# Altium schematic sheet USB_HUB.SchDoc
size A0
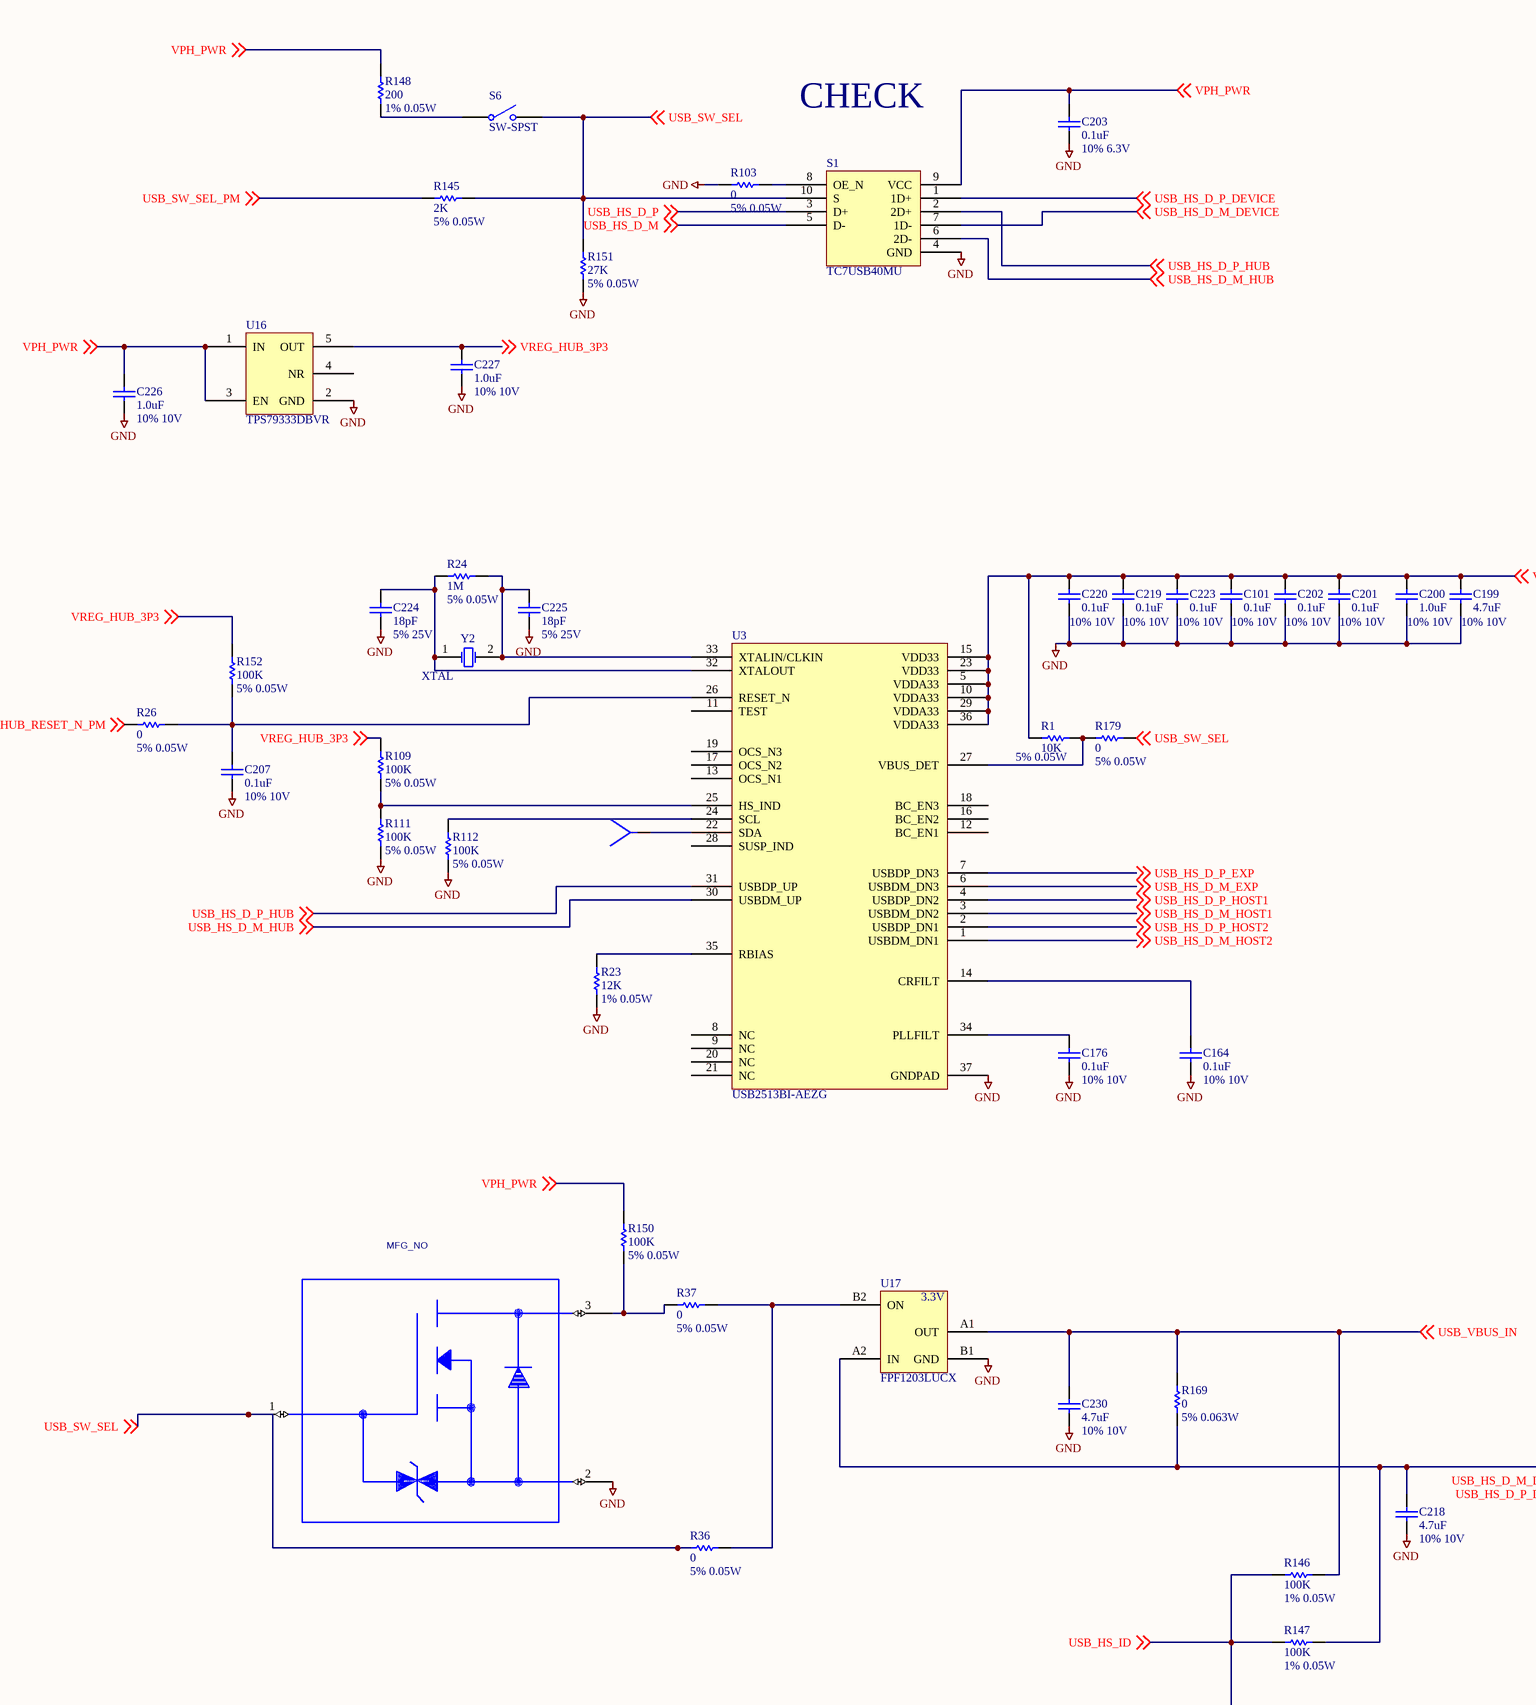
[diagram p0: USB_HUB.SchDoc, top left]
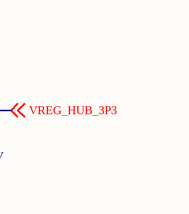
[diagram p1: USB_HUB.SchDoc, top right]
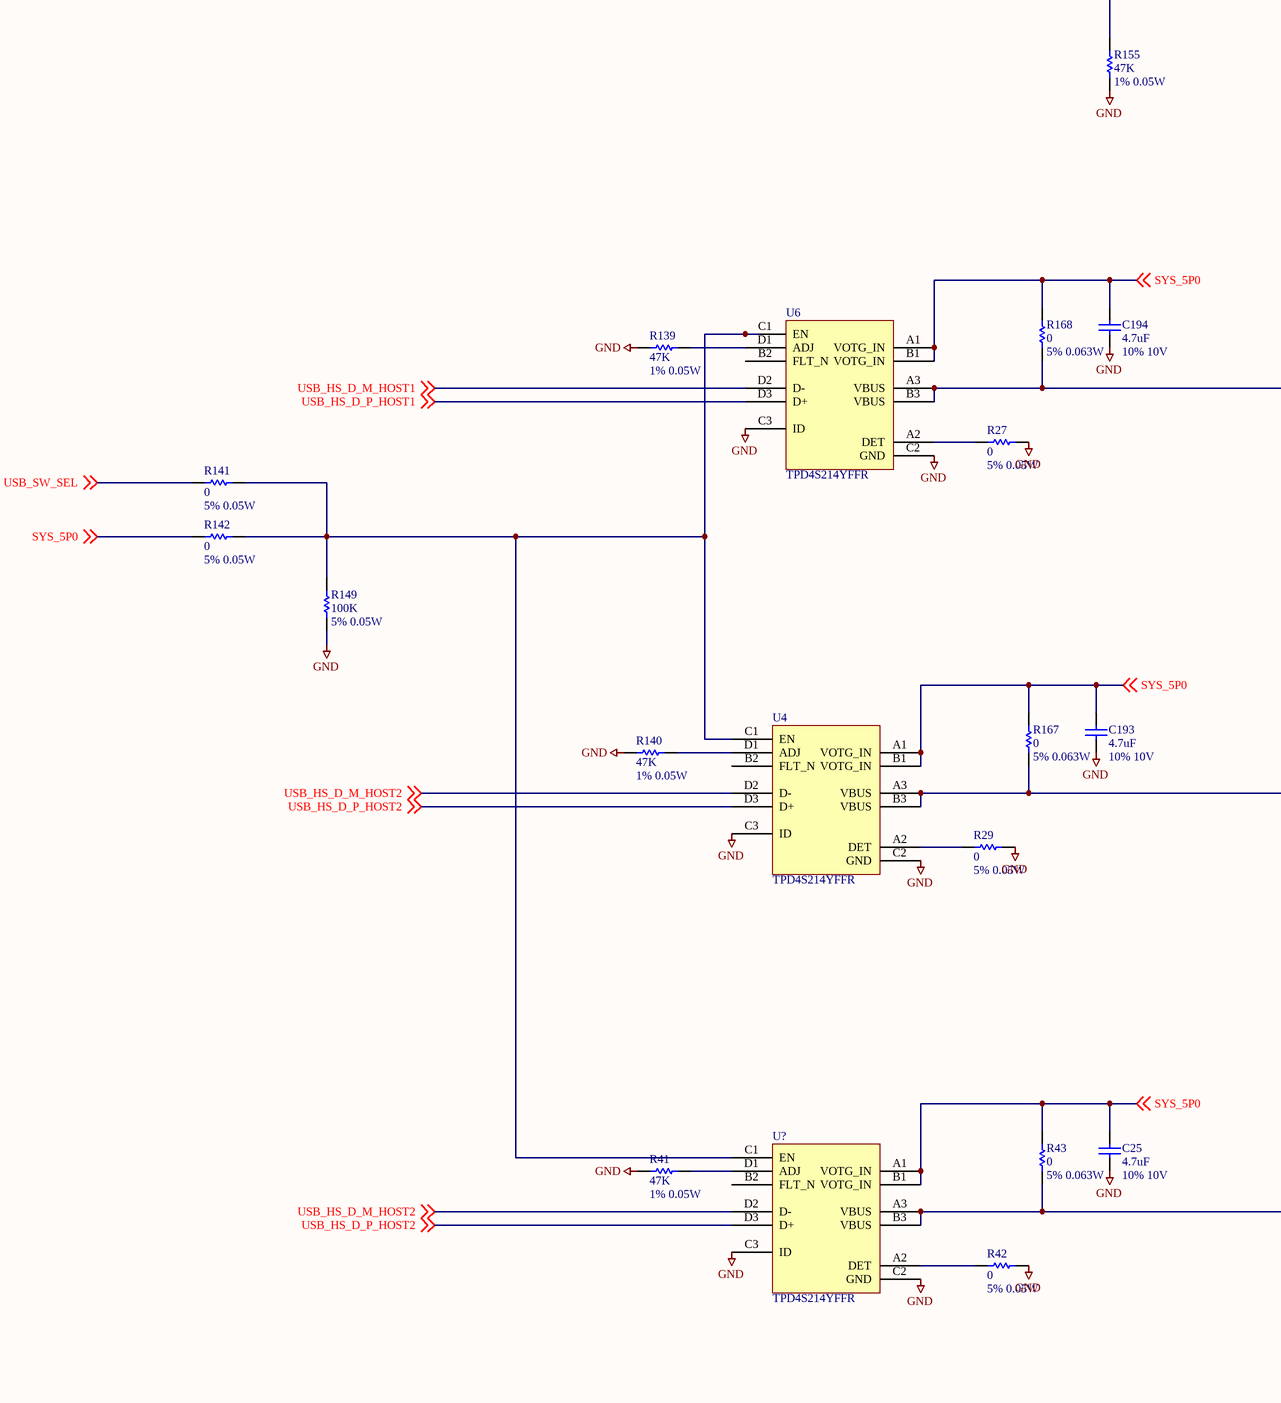
[diagram p2: USB_HUB.SchDoc, bottom left]
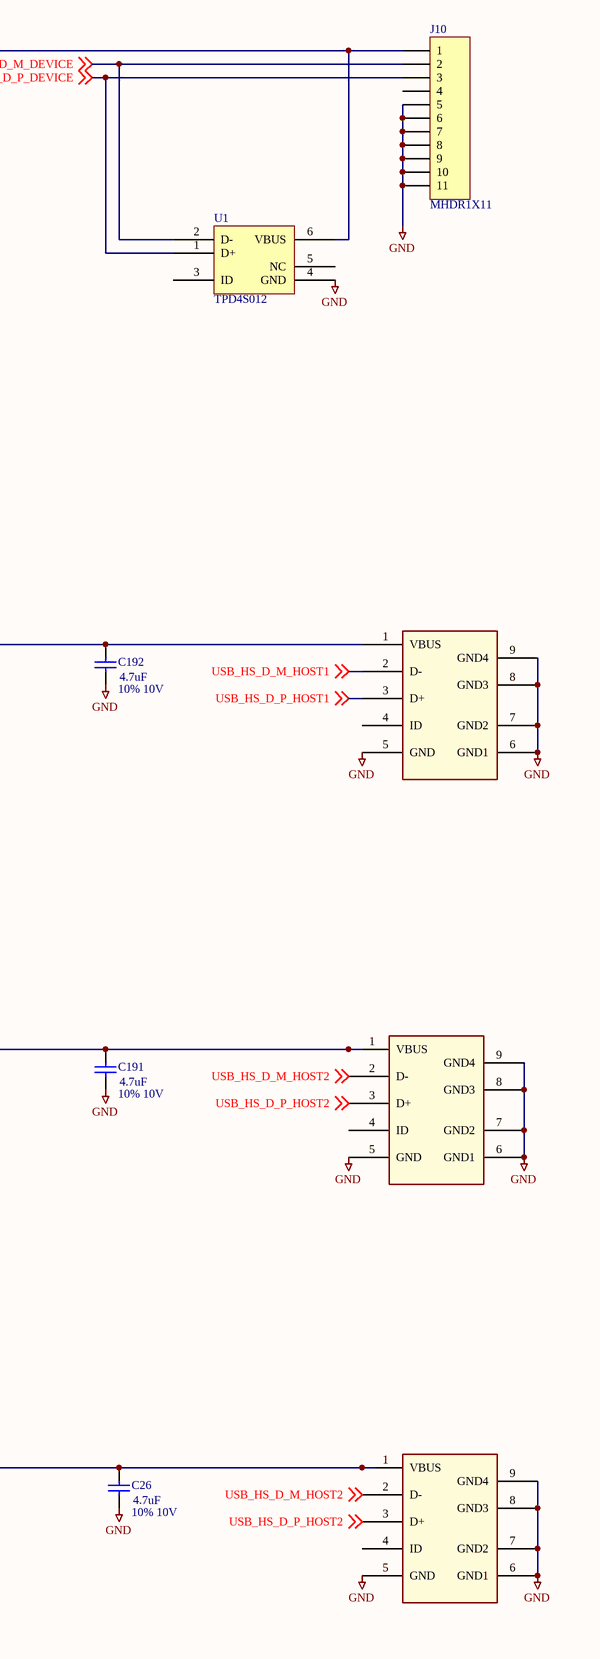
[diagram p3: USB_HUB.SchDoc, bottom right]

## Parts
C25  4.7uF  value 10% 10V  [RAD-0.3]
C26  4.7uF  value 10% 10V  [RAD-0.3]
C101  0.1uF  value 10% 10V  [RAD-0.3]
C164  0.1uF  value 10% 10V  [RAD-0.3]
C176  0.1uF  value 10% 10V  [RAD-0.3]
C191  4.7uF  value 10% 10V  [RAD-0.3]
C192  4.7uF  value 10% 10V  [RAD-0.3]
C193  4.7uF  value 10% 10V  [RAD-0.3]
C194  4.7uF  value 10% 10V  [RAD-0.3]
C199  4.7uF  value 10% 10V  [RAD-0.3]
C200  1.0uF  value 10% 10V  [RAD-0.3]
C201  0.1uF  value 10% 10V  [RAD-0.3]
C202  0.1uF  value 10% 10V  [RAD-0.3]
C203  0.1uF  value 10% 6.3V  [RAD-0.3]
C207  0.1uF  value 10% 10V  [RAD-0.3]
C218  4.7uF  value 10% 10V  [RAD-0.3]
C219  0.1uF  value 10% 10V  [RAD-0.3]
C220  0.1uF  value 10% 10V  [RAD-0.3]
C223  0.1uF  value 10% 10V  [RAD-0.3]
C224  18pF  value 5% 25V  [RAD-0.3]
C225  18pF  value 5% 25V  [RAD-0.3]
C226  1.0uF  value 10% 10V  [RAD-0.3]
C227  1.0uF  value 10% 10V  [RAD-0.3]
C230  4.7uF  value 10% 10V  [RAD-0.3]
J2  USB_SOCKET  (value not drawn)
J3  USB_SOCKET  (value not drawn)
J10  MHDR1X11  [MHDR1X11]
J?  USB_SOCKET  (value not drawn)
Q?  PART_ID: MFG_NO  (hidden comment: nfet_zener_bidir)
R1  10K  value 5% 0.05W  [AXIAL-0.3]
R23  12K  value 1% 0.05W  [AXIAL-0.3]
R24  1M  value 5% 0.05W  [AXIAL-0.3]
R26  0  value 5% 0.05W  [AXIAL-0.3]
R27  0  value 5% 0.05W  [AXIAL-0.3]
R29  0  value 5% 0.05W  [AXIAL-0.3]
R36  0  value 5% 0.05W  [AXIAL-0.3]
R37  0  value 5% 0.05W  [AXIAL-0.3]
R41  47K  value 1% 0.05W  [AXIAL-0.3]
R42  0  value 5% 0.05W  [AXIAL-0.3]
R43  0  value 5% 0.063W  [AXIAL-0.3]
R103  0  value 5% 0.05W  [AXIAL-0.3]
R109  100K  value 5% 0.05W  [AXIAL-0.3]
R111  100K  value 5% 0.05W  [AXIAL-0.3]
R112  100K  value 5% 0.05W  [AXIAL-0.3]
R139  47K  value 1% 0.05W  [AXIAL-0.3]
R140  47K  value 1% 0.05W  [AXIAL-0.3]
R141  0  value 5% 0.05W  [AXIAL-0.3]
R142  0  value 5% 0.05W  [AXIAL-0.3]
R145  2K  value 5% 0.05W  [AXIAL-0.3]
R146  100K  value 1% 0.05W  [AXIAL-0.3]
R147  100K  value 1% 0.05W  [AXIAL-0.3]
R148  200  value 1% 0.05W  [AXIAL-0.3]
R149  100K  value 5% 0.05W  [AXIAL-0.3]
R150  100K  value 5% 0.05W  [AXIAL-0.3]
R151  27K  value 5% 0.05W  [AXIAL-0.3]
R152  100K  value 5% 0.05W  [AXIAL-0.3]
R155  47K  value 1% 0.05W  [AXIAL-0.3]
R167  0  value 5% 0.063W  [AXIAL-0.3]
R168  0  value 5% 0.063W  [AXIAL-0.3]
R169  0  value 5% 0.063W  [AXIAL-0.3]
R179  0  value 5% 0.05W  [AXIAL-0.3]
S1  TC7USB40MU
S6  SW-SPST  [SPST-2]
TP18  TP  (value not drawn)
U1  TPD4S012
U3  USB2513BI-AEZG
U4  TPD4S214YFFR
U6  TPD4S214YFFR
U16  TPS79333DBVR
U17  FPF1203LUCX
U?  TPD4S214YFFR
Y2  XTAL  [R38]

## Nets
GND: C25.1 C26.2 C101.1 C164.1 C176.1 C191.2 C192.2 C193.1 C194.1 C199.1 C200.1 C201.1 C202.1 C203.2 C207.1 C218.1 C219.1 C220.1 C223.1 C224.1 C225.1 C226.1 C227.1 C230.1 J2.5(GND) J2.6(GND1) J2.7(GND2) J2.8(GND3) J2.9(GND4) J3.5(GND) J3.6(GND1) J3.7(GND2) J3.8(GND3) J3.9(GND4) J10.5 J10.6 J10.7 J10.8 J10.9 J10.10 J10.11 J?.5(GND) J?.6(GND1) J?.7(GND2) J?.8(GND3) J?.9(GND4) Q?.2(S) R23.1 R27.2 R29.2 R41.1 R42.2 R103.1 R111.1 R112.1 R139.1 R140.1 R149.1 R151.1 R155.1 S1.4(GND) U1.4(GND) U3.37(GNDPAD) U4.C2(GND) U4.C3(ID) U6.C2(GND) U6.C3(ID) U16.2(GND) U17.B1(GND) U?.C2(GND) U?.C3(ID)
SYS_5P0: C25.2 C193.2 C194.2 R43.2 R142.1 R167.2 R168.2 U4.A1(VOTG_IN) U4.B1(VOTG_IN) U6.A1(VOTG_IN) U6.B1(VOTG_IN) U?.A1(VOTG_IN) U?.B1(VOTG_IN) ; off-sheet SYS_5P0
USB_HS_D_M: S1.5(D-) ; off-sheet USB_HS_D_M
USB_HS_D_M_DEVICE: J10.2 S1.7(1D-) U1.2(D-) ; off-sheet USB_HS_D_M_DEVICE
USB_HS_D_M_EXP: U3.6(USBDM_DN3) ; off-sheet USB_HS_D_M_EXP
USB_HS_D_M_HOST1: J2.2(D-) U3.3(USBDM_DN2) U6.D2(D-) ; off-sheet USB_HS_D_M_HOST1
USB_HS_D_M_HOST2: J3.2(D-) J?.2(D-) U3.1(USBDM_DN1) U4.D2(D-) U?.D2(D-) ; off-sheet USB_HS_D_M_HOST2
USB_HS_D_M_HUB: S1.6(2D-) U3.30(USBDM_UP) ; off-sheet USB_HS_D_M_HUB
USB_HS_D_P: S1.3(D+) ; off-sheet USB_HS_D_P
USB_HS_D_P_DEVICE: J10.3 S1.1(1D+) U1.1(D+) ; off-sheet USB_HS_D_P_DEVICE
USB_HS_D_P_EXP: U3.7(USBDP_DN3) ; off-sheet USB_HS_D_P_EXP
USB_HS_D_P_HOST1: J2.3(D+) U3.4(USBDP_DN2) U6.D3(D+) ; off-sheet USB_HS_D_P_HOST1
USB_HS_D_P_HOST2: J3.3(D+) J?.3(D+) U3.2(USBDP_DN1) U4.D3(D+) U?.D3(D+) ; off-sheet USB_HS_D_P_HOST2
USB_HS_D_P_HUB: S1.2(2D+) U3.31(USBDP_UP) ; off-sheet USB_HS_D_P_HUB
USB_HS_ID: R146.1 R147.1 R155.2 ; off-sheet USB_HS_ID
USB_HUB_RESET_N_PM: R26.1 ; off-sheet USB_HUB_RESET_N_PM
USB_SW_SEL: Q?.1(G) R36.1 R141.1 R145.2 R151.2 R179.1 S1.10(S) S6.2(NO) ; off-sheet USB_SW_SEL
USB_SW_SEL_PM: R145.1 ; off-sheet USB_SW_SEL_PM
USB_VBUS_IN: C230.2 R146.2 R169.2 U17.A1(OUT) ; off-sheet USB_VBUS_IN
VPH_PWR: C203.1 C226.2 R148.2 R150.2 S1.9(VCC) U16.1(IN) U16.3(EN) ; off-sheet VPH_PWR
VREG_HUB_3P3: C101.2 C199.2 C200.2 C201.2 C202.2 C219.2 C220.2 C223.2 C227.2 R1.2 R109.2 R152.2 U3.5(VDDA33) U3.10(VDDA33) U3.15(VDD33) U3.23(VDD33) U3.29(VDDA33) U3.36(VDDA33) U16.5(OUT) ; off-sheet VREG_HUB_3P3
NetC26_1: C26.1 J?.1(VBUS) R43.1 U?.A3(VBUS) U?.B3(VBUS)
NetC164_2: C164.2 U3.14(CRFILT)
NetC176_2: C176.2 U3.34(PLLFILT)
NetC191_1: C191.1 J3.1(VBUS) R167.1 U4.A3(VBUS) U4.B3(VBUS)
NetC192_1: C192.1 J2.1(VBUS) R168.1 U6.A3(VBUS) U6.B3(VBUS)
NetC207_2: C207.2 R26.2 R152.1 U3.26(RESET_N)
NetC218_2: C218.2 J10.1 R147.2 R169.1 U1.6(VBUS) U17.A2(IN)
NetC224_2: C224.2 R24.1 U3.32(XTALOUT) Y2.1(OSC1)
NetC225_2: C225.2 R24.2 U3.33(XTALIN/CLKIN) Y2.2(OSC2)
NetQ?_3: Q?.3(D) R37.1 R150.1
NetR1_1: R1.1 R179.2 U3.27(VBUS_DET)
NetR23_2: R23.2 U3.35(RBIAS)
NetR27_1: R27.1 U6.A2(DET)
NetR29_1: R29.1 U4.A2(DET)
NetR36_2: R36.2 R37.2 U17.B2(ON)
NetR41_2: R41.2 U?.D1(ADJ)
NetR42_1: R42.1 U?.A2(DET)
NetR103_2: R103.2 S1.8(OE_N)
NetR109_1: R109.1 R111.2 U3.25(HS_IND)
NetR112_2: R112.2 U3.24(SCL)
NetR139_2: R139.2 U6.D1(ADJ)
NetR140_2: R140.2 U4.D1(ADJ)
NetR141_2: R141.2 R142.2 R149.2 U4.C1(EN) U6.C1(EN) U?.C1(EN)
NetR148_1: R148.1 S6.1(COMMON)
NetTP18_1: TP18.1(IO1) U3.22(SDA)

Not connected (* = marked no-connect by the designer): J2 4(ID); J3 4(ID); J10 4; J? 4(ID); U1 3(ID) 5(NC); U3 8(NC) 9(NC) 11(TEST) 12(BC_EN1) 13(OCS_N1) 16(BC_EN2) 17(OCS_N2) 18(BC_EN3) 19(OCS_N3) 20(NC) 21(NC) 28(SUSP_IND); U4 B2(FLT_N); U6 B2(FLT_N); U16 4(NR); U? B2(FLT_N)

## Notes on the sheet
- CHECK
- (in symbol FPF1203LUCX) 3.3V

## Library data of the parts
C25 C26 C101 C164 C176 C191-C194 C199-C203 C207 C218-C220 C223-C227 C230 = Cap: Capacitor; Published: 8-Jun-2000; LatestRevisionDate: 17-Jul-2002; LatestRevisionNote: Re-released for DXP Platform.; PackageReference: RAD-0.3; Publisher: Altium Limited; PackageDescription: Radial Cap, Thru-Hole; 2 Leads; 0.3 in Pin Spacing
J10 = MHDR1X11: Header, 11-Pin; LatestRevisionDate: 17-Jul-2002; LatestRevisionNote: Re-released for DXP Platform.; Publisher: Altium Limited
Q? = NFET_ZENER_BIDIR: PART_NUMBER: MCN_NO; OriginalSymbolOrigin: (-525,450); CDS_LMAN_SYM_OUTLINE: -475,450,475,-450; SYMNAME: nfet_zener_bidir; PACK_TYPE: ?
R1 R23 R24 R26 R27 R29 R36 R37 R41-R43 R103 R109 R111 R112 R139-R142 R145-R152 R155 R167-R169 R179 = Res1: Resistor; Published: 8-Jun-2000; LatestRevisionDate: 17-Jul-2002; LatestRevisionNote: Re-released for DXP Platform.; PackageReference: AXIAL-0.3; Publisher: Altium Limited; PackageDescription: Axial Device, Thru-Hole; 2 Leads; 0.3 in Pin Spacing
S6 = SW-SPST: Single-Pole, Single-Throw Switch; Published: 24-Mar-1999; LatestRevisionDate: 17-Jul-2002; LatestRevisionNote: Re-released for DXP Platform.; PackageReference: SPST-2; Publisher: Altium Limited; PackageDescription: Switch; 2 Leads
TP18 = TP_Dup1: PART_NUMBER: MCN_NO; PART_ID: MFG_NO; OriginalSymbolOrigin: (-50,75); CDS_LMAN_SYM_OUTLINE: -50,75,50,0; SYMNAME: TP; PACK_TYPE: TP
Y2 = XTAL: Crystal Oscillator; Published: 8-Jun-2000; LatestRevisionDate: 17-Jul-2002; LatestRevisionNote: Re-released for DXP Platform.; PackageReference: R38; Publisher: Altium Limited; PackageDescription: Crystal, Thru-Hole; 2 Leads; Body 3.1 x 8.2 mm (Dia.xH)